# Altium schematic sheet Sheet2.SchDoc
size A; SheetNumber: 1; SheetTotal: 1
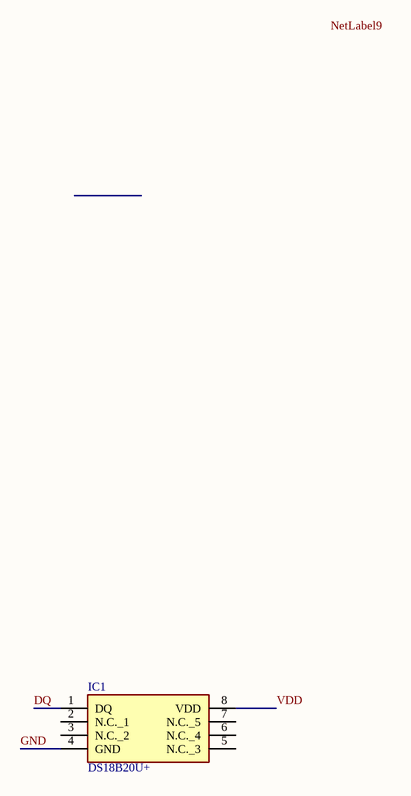
[diagram p0: Sheet2.SchDoc]

## Parts
IC1  DS18B20U+  [SOP65P490X110-8N]

## Nets
DQ: IC1.1(DQ)
GND: IC1.4(GND)
VDD: IC1.8(VDD)

Not connected (* = marked no-connect by the designer): IC1 2(N.C._1) 3(N.C._2) 5(N.C._3) 6(N.C._4) 7(N.C._5)

## Notes on the sheet
- Labels drawn without touching a wire or pin: NetLabel9

## Library data of the parts
IC1 = DS18B20U+: Integrated Circuit; Manufacturer_Name: Analog Devices; Datasheet Link: https://datasheets.maximintegrated.com/en/ds/DS18B20.pdf; Height: 1.1mm; Manufacturer_Part_Number: DS18B20U+; Mouser Part Number: 700-DS18B20U; Mouser Price/Stock: https://www.mouser.co.uk/ProductDetail/Analog-Devices-Maxim-Integrated/DS18B20U%2b?qs=7H2Jq%252ByxpJLxAEcPXZtrFQ%3D%3D; Arrow Part Number: DS18B20U+; Arrow Price/Stock: https://www.arrow.com/en/products/ds18b20u/analog-devices?utm_currency=USD&region=nac